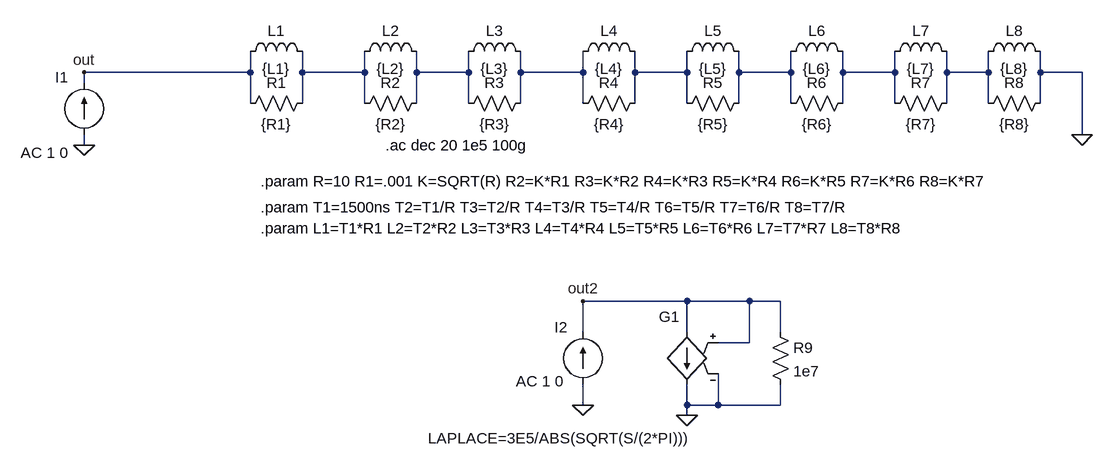
[diagram p0: schematic LaplaceSkin.asc]
LaplaceSkin.asc, the LTspice schematic file:
Version 4
SHEET 1 1636 896
WIRE 336 288 80 288
WIRE 80 304 80 288
WIRE 80 400 80 384
WIRE 752 288 848 288
WIRE 336 256 336 288
WIRE 416 256 416 288
WIRE 512 256 512 288
WIRE 592 256 592 288
WIRE 672 256 672 288
WIRE 752 256 752 288
WIRE 416 288 512 288
WIRE 416 288 416 336
WIRE 512 288 512 336
WIRE 592 288 672 288
WIRE 592 288 592 336
WIRE 672 288 672 336
WIRE 336 288 336 336
WIRE 752 288 752 336
WIRE 928 288 1008 288
WIRE 848 256 848 288
WIRE 928 256 928 288
WIRE 928 288 928 336
WIRE 848 288 848 336
WIRE 1008 256 1008 288
WIRE 1088 256 1088 288
WIRE 1008 288 1008 336
WIRE 1168 288 1088 288
WIRE 1088 288 1088 336
WIRE 1168 256 1168 288
WIRE 1248 256 1248 288
WIRE 1328 288 1248 288
WIRE 1248 288 1248 336
WIRE 1168 288 1168 336
WIRE 1328 256 1328 288
WIRE 1408 256 1408 288
WIRE 1472 288 1408 288
WIRE 1408 288 1408 336
WIRE 1328 288 1328 336
WIRE 1616 384 1616 288
WIRE 1472 256 1472 288
WIRE 1552 256 1552 288
WIRE 1616 288 1552 288
WIRE 1552 288 1552 336
WIRE 1472 288 1472 336
WIRE 848 800 848 768
WIRE 848 688 848 640
WIRE 1008 816 1008 800
WIRE 1008 688 1008 640
WIRE 1008 640 1104 640
WIRE 1104 640 1104 704
WIRE 1104 704 1056 704
WIRE 1008 800 1056 800
WIRE 1008 800 1008 768
WIRE 1056 800 1056 752
WIRE 1008 640 848 640
WIRE 1104 640 1152 640
WIRE 1152 640 1152 688
WIRE 1152 768 1152 800
WIRE 1152 800 1056 800
FLAG 80 400 0
FLAG 80 288 out
FLAG 1616 384 0
FLAG 848 800 0
FLAG 1008 816 0
FLAG 848 640 out2
SYMBOL ind 320 272 R270
WINDOW 0 32 56 VTop 0
WINDOW 3 5 56 VBottom 0
SYMATTR InstName L1
SYMATTR Value {L1}
SYMBOL ind 496 272 R270
WINDOW 0 32 56 VTop 0
WINDOW 3 5 56 VBottom 0
SYMATTR InstName L2
SYMATTR Value {L2}
SYMBOL ind 656 272 R270
WINDOW 0 32 56 VTop 0
WINDOW 3 5 56 VBottom 0
SYMATTR InstName L3
SYMATTR Value {L3}
SYMBOL res 432 320 R90
WINDOW 0 0 56 VBottom 0
WINDOW 3 32 56 VTop 0
SYMATTR InstName R1
SYMATTR Value {R1}
SYMBOL res 608 320 R90
WINDOW 0 0 56 VBottom 0
WINDOW 3 32 56 VTop 0
SYMATTR InstName R2
SYMATTR Value {R2}
SYMBOL res 768 320 R90
WINDOW 0 0 56 VBottom 0
WINDOW 3 32 56 VTop 0
SYMATTR InstName R3
SYMATTR Value {R3}
SYMBOL current 80 384 R180
WINDOW 0 24 88 Left 0
WINDOW 3 24 0 Left 0
WINDOW 123 24 -28 Left 0
WINDOW 39 0 0 Left 0
SYMATTR InstName I1
SYMATTR Value ""
SYMATTR Value2 AC 1 0
SYMBOL ind 832 272 R270
WINDOW 0 32 56 VTop 0
WINDOW 3 5 56 VBottom 0
SYMATTR InstName L4
SYMATTR Value {L4}
SYMBOL res 944 320 R90
WINDOW 0 0 56 VBottom 0
WINDOW 3 32 56 VTop 0
SYMATTR InstName R4
SYMATTR Value {R4}
SYMBOL ind 992 272 R270
WINDOW 0 32 56 VTop 0
WINDOW 3 5 56 VBottom 0
SYMATTR InstName L5
SYMATTR Value {L5}
SYMBOL res 1104 320 R90
WINDOW 0 0 56 VBottom 0
WINDOW 3 32 56 VTop 0
SYMATTR InstName R5
SYMATTR Value {R5}
SYMBOL ind 1152 272 R270
WINDOW 0 32 56 VTop 0
WINDOW 3 5 56 VBottom 0
SYMATTR InstName L6
SYMATTR Value {L6}
SYMBOL res 1264 320 R90
WINDOW 0 0 56 VBottom 0
WINDOW 3 32 56 VTop 0
SYMATTR InstName R6
SYMATTR Value {R6}
SYMBOL ind 1312 272 R270
WINDOW 0 32 56 VTop 0
WINDOW 3 5 56 VBottom 0
SYMATTR InstName L7
SYMATTR Value {L7}
SYMBOL res 1424 320 R90
WINDOW 0 0 56 VBottom 0
WINDOW 3 32 56 VTop 0
SYMATTR InstName R7
SYMATTR Value {R7}
SYMBOL ind 1456 272 R270
WINDOW 0 32 56 VTop 0
WINDOW 3 5 56 VBottom 0
SYMATTR InstName L8
SYMATTR Value {L8}
SYMBOL res 1568 320 R90
WINDOW 0 0 56 VBottom 0
WINDOW 3 32 56 VTop 0
SYMATTR InstName R8
SYMATTR Value {R8}
SYMBOL current 848 768 R180
WINDOW 0 24 88 Left 0
WINDOW 3 24 0 Left 0
WINDOW 123 30 5 Left 0
WINDOW 39 0 0 Left 0
SYMATTR InstName I2
SYMATTR Value ""
SYMATTR Value2 AC 1 0
SYMBOL g2 1008 784 R180
WINDOW 0 11 120 Left 0
WINDOW 3 -3 -67 Left 0
SYMATTR InstName G1
SYMATTR Value LAPLACE=3E5/ABS(SQRT(S/(2*PI)))
SYMBOL res 1136 672 R0
SYMATTR InstName R9
SYMATTR Value 1e7
TEXT 544 400 Left 0 !.ac dec 20 1e5 100g
TEXT 352 456 Left 0 !.param R=10 R1=.001 K=SQRT(R) R2=K*R1 R3=K*R2 R4=K*R3 R5=K*R4 R6=K*R5 R7=K*R6 R8=K*R7
TEXT 352 496 Left 0 !.param T1=1500ns T2=T1/R T3=T2/R T4=T3/R T5=T4/R T6=T5/R T7=T6/R T8=T7/R
TEXT 352 528 Left 0 !.param L1=T1*R1 L2=T2*R2 L3=T3*R3 L4=T4*R4 L5=T5*R5 L6=T6*R6 L7=T7*R7 L8=T8*R8

The netlist it stands for:
* LaplaceSkin.asc
L1 out N002 {L1}
L2 N002 N003 {L2}
L3 N003 N001 {L3}
R1 N002 out {R1}
R2 N003 N002 {R2}
R3 N001 N003 {R3}
I1 0 out AC 1 0
L4 N001 N004 {L4}
R4 N004 N001 {R4}
L5 N004 N005 {L5}
R5 N005 N004 {R5}
L6 N005 N006 {L6}
R6 N006 N005 {R6}
L7 N006 N007 {L7}
R7 N007 N006 {R7}
L8 N007 0 {L8}
R8 0 N007 {R8}
I2 0 out2 AC 1 0
G1 out2 0 out2 0 LAPLACE=3E5/ABS(SQRT(S/(2*PI)))
R9 out2 0 1e7
.ac dec 20 1e5 100g
.param R=10 R1=.001 K=SQRT(R) R2=K*R1 R3=K*R2 R4=K*R3 R5=K*R4 R6=K*R5 R7=K*R6 R8=K*R7
.param T1=1500ns T2=T1/R T3=T2/R T4=T3/R T5=T4/R T6=T5/R T7=T6/R T8=T7/R
.param L1=T1*R1 L2=T2*R2 L3=T3*R3 L4=T4*R4 L5=T5*R5 L6=T6*R6 L7=T7*R7 L8=T8*R8
.backanno
.end